# EAGLE schematic turbo (EAGLE 7.3.0)
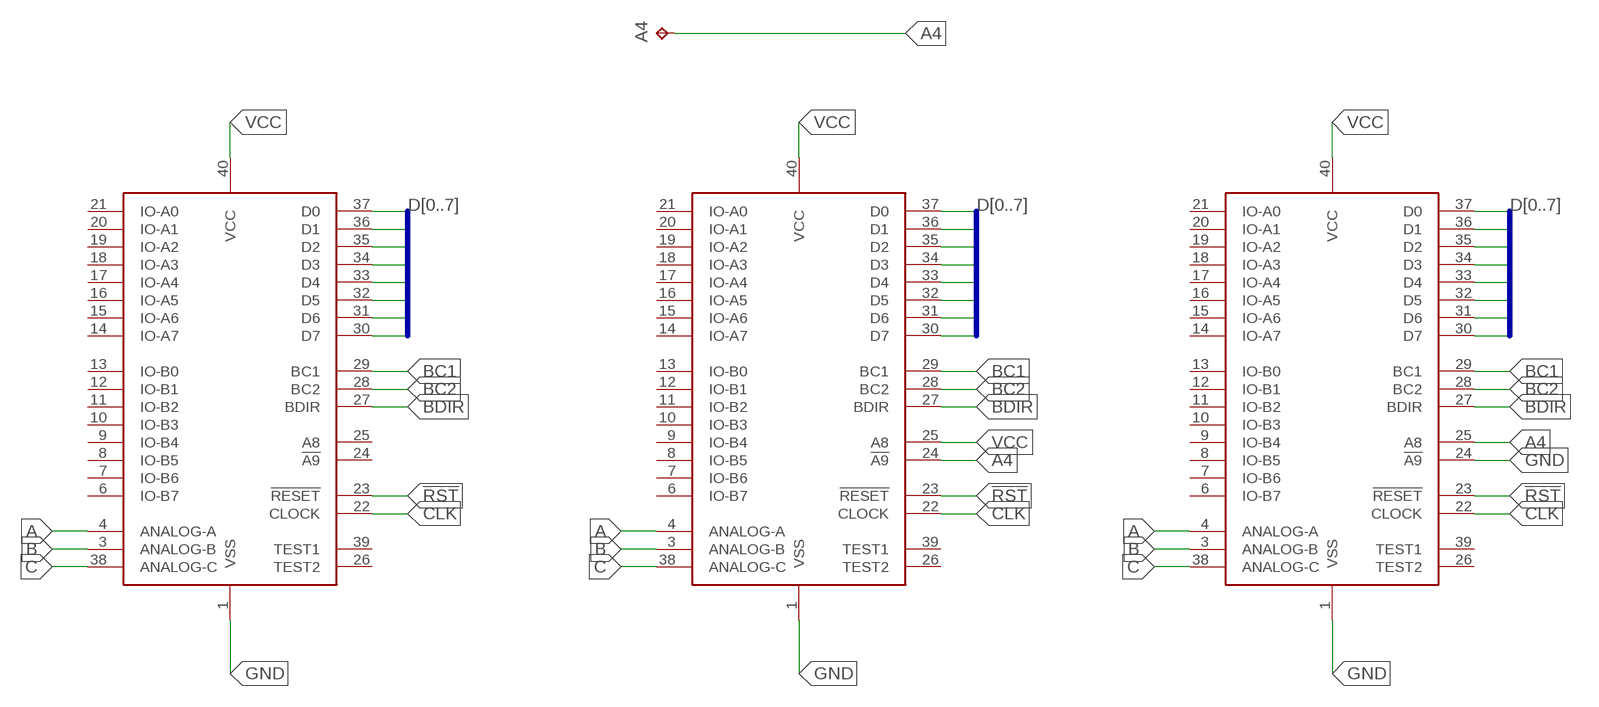
[diagram p0: schematic, sheet 1]

## Parts
A4  TPB1,27  [B1,27]
AY1  AY-3-8910  [DIL40]
AY2  AY-3-8910  [DIL40]
INPUT  AY-3-8910  [DIL40]

## Nets
!RST: AY1.23(!RESET) AY2.23(!RESET) INPUT.23(!RESET)
A: AY1.4(ANALOG-A) AY2.4(ANALOG-A) INPUT.4(ANALOG-A)
A4: A4.TP AY1.24(!A9) AY2.25(A8)
B: AY1.3(ANALOG-B) AY2.3(ANALOG-B) INPUT.3(ANALOG-B)
BC1: AY1.29(BC1) AY2.29(BC1) INPUT.29(BC1)
BC2: AY1.28(BC2) AY2.28(BC2) INPUT.28(BC2)
BDIR: AY1.27(BDIR) AY2.27(BDIR) INPUT.27(BDIR)
C: AY1.38(ANALOG-C) AY2.38(ANALOG-C) INPUT.38(ANALOG-C)
CLK: AY1.22(CLOCK) AY2.22(CLOCK) INPUT.22(CLOCK)
D0: AY1.37(D0) AY2.37(D0) INPUT.37(D0)
D1: AY1.36(D1) AY2.36(D1) INPUT.36(D1)
D2: AY1.35(D2) AY2.35(D2) INPUT.35(D2)
D3: AY1.34(D3) AY2.34(D3) INPUT.34(D3)
D4: AY1.33(D4) AY2.33(D4) INPUT.33(D4)
D5: AY1.32(D5) AY2.32(D5) INPUT.32(D5)
D6: AY1.31(D6) AY2.31(D6) INPUT.31(D6)
D7: AY1.30(D7) AY2.30(D7) INPUT.30(D7)
GND: AY1.1(VSS) AY2.1(VSS) AY2.24(!A9) INPUT.1(VSS)
VCC: AY1.25(A8) AY1.40(VCC) AY2.40(VCC) INPUT.40(VCC)
Unconnected: AY1.6(IO-B7) AY1.7(IO-B6) AY1.8(IO-B5) AY1.9(IO-B4) AY1.10(IO-B3) AY1.11(IO-B2) AY1.12(IO-B1) AY1.13(IO-B0) AY1.14(IO-A7) AY1.15(IO-A6) AY1.16(IO-A5) AY1.17(IO-A4) AY1.18(IO-A3) AY1.19(IO-A2) AY1.20(IO-A1) AY1.21(IO-A0) AY1.26(TEST2) AY1.39(TEST1) AY2.6(IO-B7) AY2.7(IO-B6) AY2.8(IO-B5) AY2.9(IO-B4) AY2.10(IO-B3) AY2.11(IO-B2) AY2.12(IO-B1) AY2.13(IO-B0) AY2.14(IO-A7) AY2.15(IO-A6) AY2.16(IO-A5) AY2.17(IO-A4) AY2.18(IO-A3) AY2.19(IO-A2) AY2.20(IO-A1) AY2.21(IO-A0) AY2.26(TEST2) AY2.39(TEST1) INPUT.6(IO-B7) INPUT.7(IO-B6) INPUT.8(IO-B5) INPUT.9(IO-B4) INPUT.10(IO-B3) INPUT.11(IO-B2) INPUT.12(IO-B1) INPUT.13(IO-B0) INPUT.14(IO-A7) INPUT.15(IO-A6) INPUT.16(IO-A5) INPUT.17(IO-A4) INPUT.18(IO-A3) INPUT.19(IO-A2) INPUT.20(IO-A1) INPUT.21(IO-A0) INPUT.24(!A9) INPUT.25(A8) INPUT.26(TEST2) INPUT.39(TEST1)

## Buses
D[0..7]

## Library data of the parts
A4 = testpad:TP: Test pad
AY1 AY2 INPUT = ay-3891x:AY-3-8910